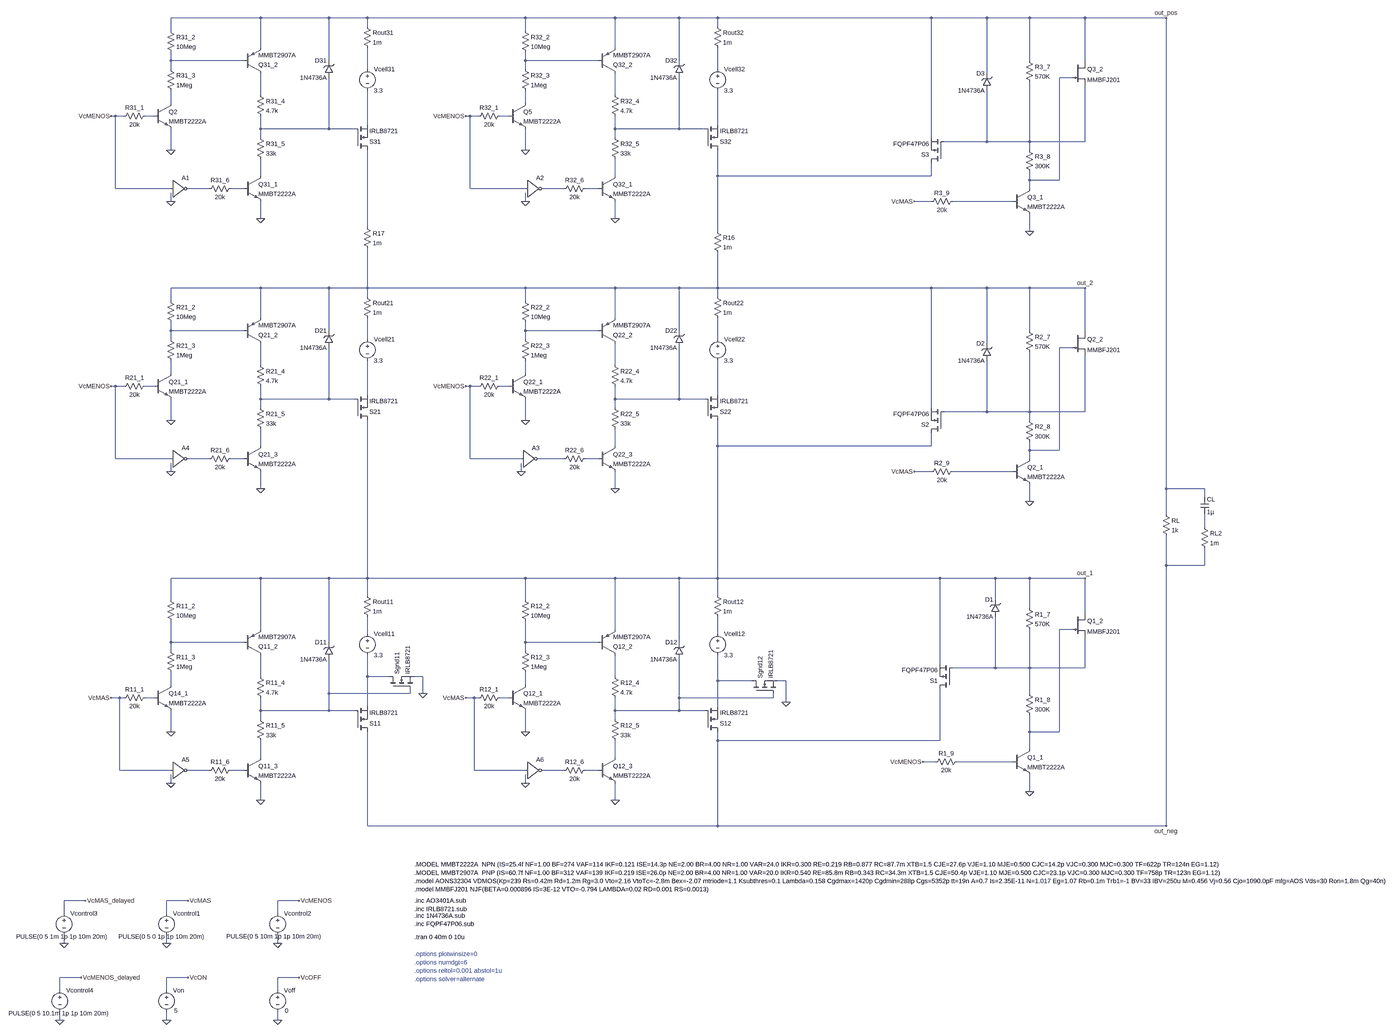
[diagram p0: schematic Matriz3x2 - Nuevo PMOS - FQPF47P06.asc, whole sheet]
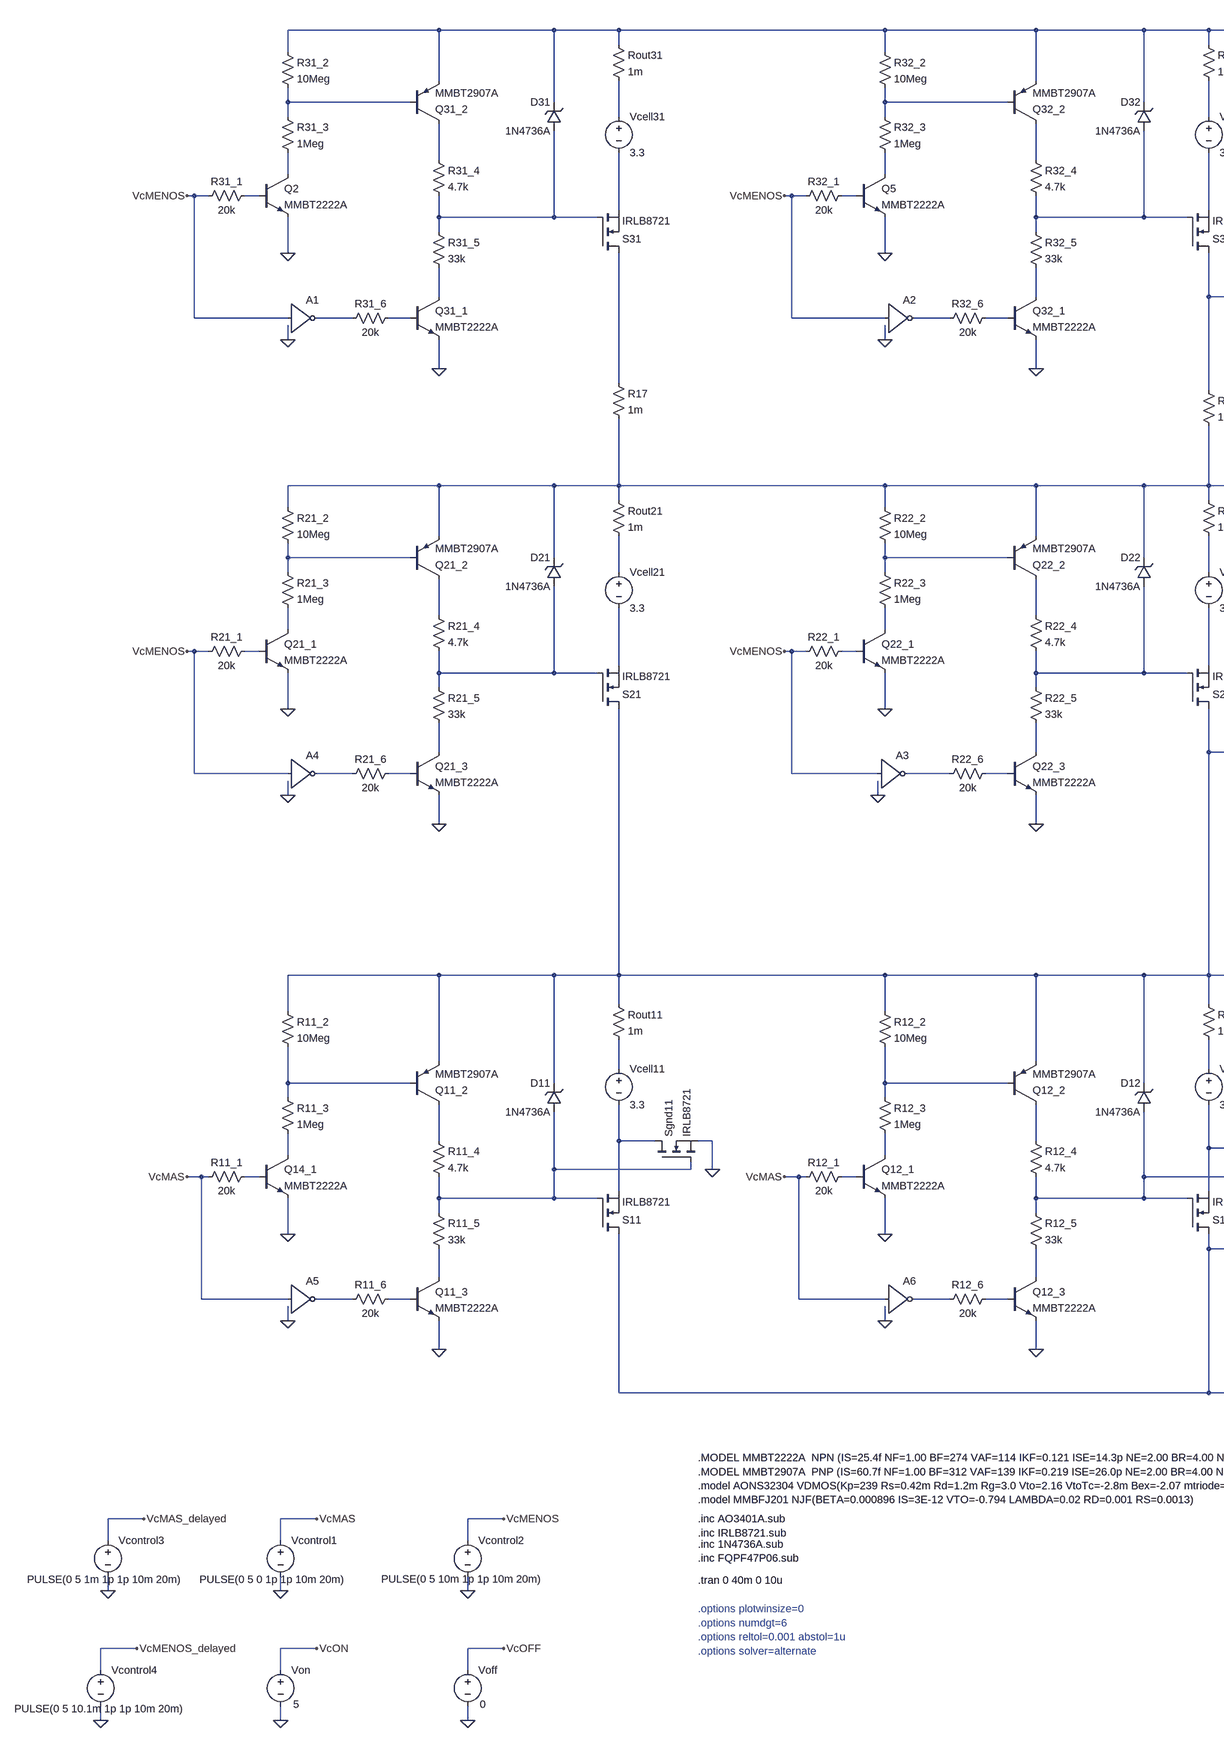
[diagram p1: schematic Matriz3x2 - Nuevo PMOS - FQPF47P06.asc, part, row 1 of 1, column 1 of 2]
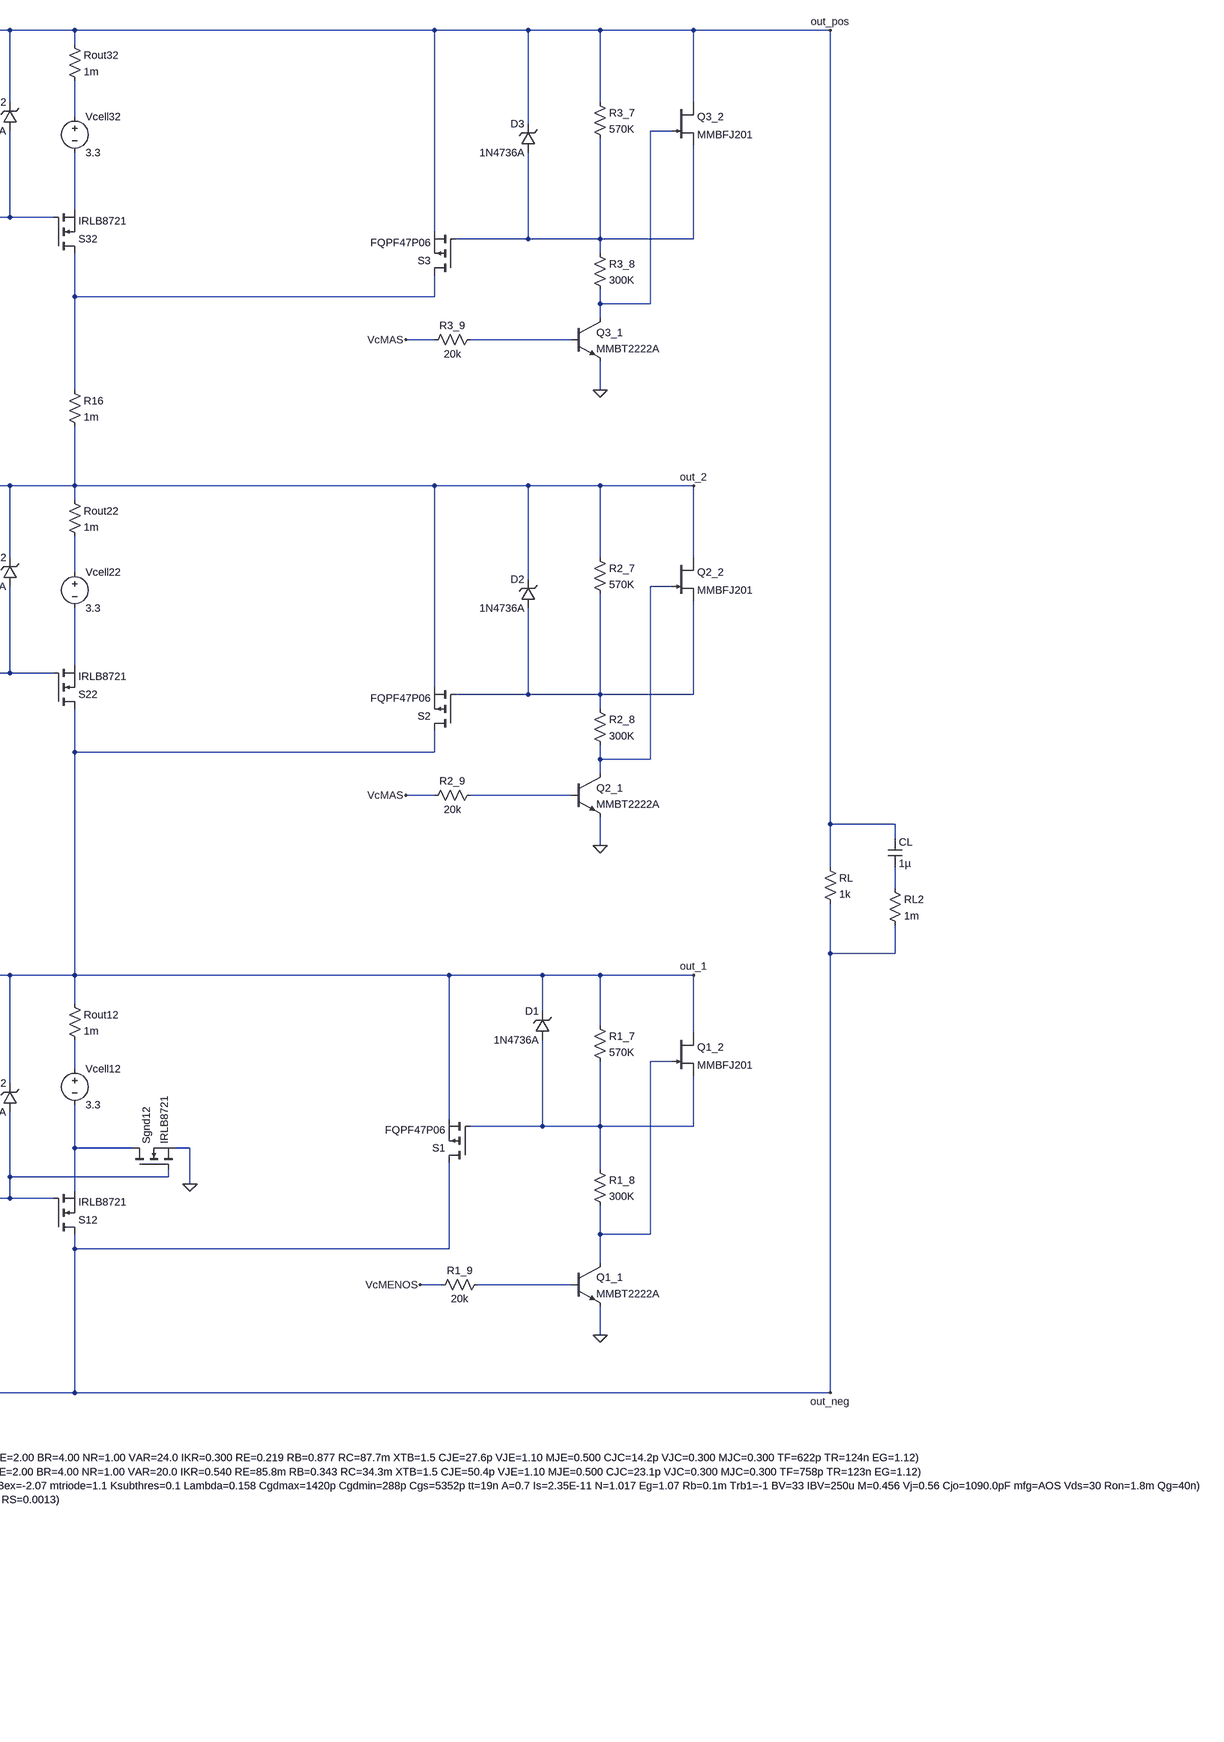
[diagram p2: schematic Matriz3x2 - Nuevo PMOS - FQPF47P06.asc, part, row 1 of 1, column 2 of 2]
Matriz3x2 - Nuevo PMOS - FQPF47P06.asc, the LTspice schematic file:
Version 4.1
SHEET 1 5536 2128
WIRE -800 -2512 -1136 -2512
WIRE -544 -2512 -800 -2512
WIRE -400 -2512 -544 -2512
WIRE 192 -2512 -400 -2512
WIRE 528 -2512 192 -2512
WIRE 768 -2512 528 -2512
WIRE 912 -2512 768 -2512
WIRE 1712 -2512 912 -2512
WIRE 1920 -2512 1712 -2512
WIRE 2080 -2512 1920 -2512
WIRE 2288 -2512 2080 -2512
WIRE 2592 -2512 2288 -2512
WIRE -400 -2480 -400 -2512
WIRE 912 -2480 912 -2512
WIRE -1136 -2464 -1136 -2512
WIRE 192 -2464 192 -2512
WIRE -800 -2400 -800 -2512
WIRE 528 -2400 528 -2512
WIRE -1136 -2352 -1136 -2384
WIRE -864 -2352 -1136 -2352
WIRE -544 -2352 -544 -2512
WIRE 192 -2352 192 -2384
WIRE 464 -2352 192 -2352
WIRE 768 -2352 768 -2512
WIRE 2080 -2352 2080 -2512
WIRE 2288 -2352 2288 -2512
WIRE -1136 -2320 -1136 -2352
WIRE -400 -2320 -400 -2400
WIRE 192 -2320 192 -2352
WIRE 912 -2320 912 -2400
WIRE 1920 -2304 1920 -2512
WIRE 2240 -2288 2192 -2288
WIRE -800 -2224 -800 -2304
WIRE 528 -2224 528 -2304
WIRE -1136 -2192 -1136 -2240
WIRE 192 -2192 192 -2240
WIRE -1344 -2144 -1360 -2144
WIRE -1312 -2144 -1344 -2144
WIRE -1200 -2144 -1232 -2144
WIRE -16 -2144 -32 -2144
WIRE 16 -2144 -16 -2144
WIRE 128 -2144 96 -2144
WIRE -400 -2112 -400 -2240
WIRE 912 -2112 912 -2240
WIRE -800 -2096 -800 -2144
WIRE -544 -2096 -544 -2288
WIRE -544 -2096 -800 -2096
WIRE -448 -2096 -544 -2096
WIRE 528 -2096 528 -2144
WIRE 768 -2096 768 -2288
WIRE 768 -2096 528 -2096
WIRE 864 -2096 768 -2096
WIRE -800 -2064 -800 -2096
WIRE 528 -2064 528 -2096
WIRE 1712 -2064 1712 -2512
WIRE 1920 -2048 1920 -2240
WIRE 1920 -2048 1760 -2048
WIRE 2080 -2048 2080 -2272
WIRE 2080 -2048 1920 -2048
WIRE 2288 -2048 2288 -2256
WIRE 2288 -2048 2080 -2048
WIRE -1136 -2016 -1136 -2096
WIRE 192 -2016 192 -2096
WIRE 2080 -2016 2080 -2048
WIRE -800 -1920 -800 -1984
WIRE 528 -1920 528 -1984
WIRE 912 -1920 912 -2016
WIRE 1712 -1920 1712 -1968
WIRE 1712 -1920 912 -1920
WIRE 2080 -1904 2080 -1936
WIRE 2192 -1904 2192 -2288
WIRE 2192 -1904 2080 -1904
WIRE -1344 -1872 -1344 -2144
WIRE -1136 -1872 -1344 -1872
WIRE -992 -1872 -1072 -1872
WIRE -864 -1872 -912 -1872
WIRE -16 -1872 -16 -2144
WIRE 192 -1872 -16 -1872
WIRE 336 -1872 256 -1872
WIRE 464 -1872 416 -1872
WIRE 2080 -1872 2080 -1904
WIRE -1136 -1824 -1136 -1856
WIRE 192 -1824 192 -1856
WIRE 1712 -1824 1648 -1824
WIRE 2016 -1824 1792 -1824
WIRE -800 -1760 -800 -1824
WIRE 528 -1760 528 -1824
WIRE -400 -1728 -400 -2016
WIRE 912 -1712 912 -1920
WIRE 2080 -1712 2080 -1776
WIRE -800 -1456 -1136 -1456
WIRE -544 -1456 -800 -1456
WIRE -400 -1456 -400 -1648
WIRE -400 -1456 -544 -1456
WIRE 192 -1456 -400 -1456
WIRE 528 -1456 192 -1456
WIRE 768 -1456 528 -1456
WIRE 912 -1456 912 -1632
WIRE 912 -1456 768 -1456
WIRE 1712 -1456 912 -1456
WIRE 1920 -1456 1712 -1456
WIRE 2080 -1456 1920 -1456
WIRE 2288 -1456 2080 -1456
WIRE -400 -1424 -400 -1456
WIRE 912 -1424 912 -1456
WIRE -1136 -1408 -1136 -1456
WIRE 192 -1408 192 -1456
WIRE -800 -1344 -800 -1456
WIRE 528 -1344 528 -1456
WIRE -1136 -1296 -1136 -1328
WIRE -864 -1296 -1136 -1296
WIRE -544 -1296 -544 -1456
WIRE 192 -1296 192 -1328
WIRE 464 -1296 192 -1296
WIRE 768 -1296 768 -1456
WIRE 2080 -1296 2080 -1456
WIRE 2288 -1296 2288 -1456
WIRE -1136 -1264 -1136 -1296
WIRE -400 -1264 -400 -1344
WIRE 192 -1264 192 -1296
WIRE 912 -1264 912 -1344
WIRE 1920 -1248 1920 -1456
WIRE 2240 -1232 2192 -1232
WIRE -800 -1168 -800 -1248
WIRE 528 -1168 528 -1248
WIRE -1136 -1136 -1136 -1184
WIRE 192 -1136 192 -1184
WIRE -1344 -1088 -1360 -1088
WIRE -1312 -1088 -1344 -1088
WIRE -1200 -1088 -1232 -1088
WIRE -16 -1088 -32 -1088
WIRE 16 -1088 -16 -1088
WIRE 128 -1088 96 -1088
WIRE -400 -1056 -400 -1184
WIRE 912 -1056 912 -1184
WIRE -800 -1040 -800 -1088
WIRE -544 -1040 -544 -1232
WIRE -544 -1040 -800 -1040
WIRE -448 -1040 -544 -1040
WIRE 528 -1040 528 -1088
WIRE 768 -1040 768 -1232
WIRE 768 -1040 528 -1040
WIRE 864 -1040 768 -1040
WIRE -800 -1008 -800 -1040
WIRE 528 -1008 528 -1040
WIRE 1712 -1008 1712 -1456
WIRE 1920 -992 1920 -1184
WIRE 1920 -992 1760 -992
WIRE 2080 -992 2080 -1216
WIRE 2080 -992 1920 -992
WIRE 2288 -992 2288 -1200
WIRE 2288 -992 2080 -992
WIRE -1136 -960 -1136 -1040
WIRE 192 -960 192 -1040
WIRE 2080 -960 2080 -992
WIRE -800 -864 -800 -928
WIRE 528 -864 528 -928
WIRE 912 -864 912 -960
WIRE 1712 -864 1712 -912
WIRE 1712 -864 912 -864
WIRE 2080 -848 2080 -880
WIRE 2192 -848 2192 -1232
WIRE 2192 -848 2080 -848
WIRE -1344 -816 -1344 -1088
WIRE -1136 -816 -1344 -816
WIRE -992 -816 -1072 -816
WIRE -864 -816 -912 -816
WIRE -16 -816 -16 -1088
WIRE 176 -816 -16 -816
WIRE 336 -816 240 -816
WIRE 464 -816 416 -816
WIRE 2080 -816 2080 -848
WIRE -1136 -768 -1136 -800
WIRE 176 -768 176 -800
WIRE 1712 -768 1648 -768
WIRE 2016 -768 1792 -768
WIRE -800 -704 -800 -768
WIRE 528 -704 528 -768
WIRE 2592 -704 2592 -2512
WIRE 2736 -704 2592 -704
WIRE 2736 -672 2736 -704
WIRE 2080 -656 2080 -720
WIRE 2592 -608 2592 -704
WIRE 2736 -560 2736 -608
WIRE 2592 -416 2592 -528
WIRE 2736 -416 2736 -480
WIRE 2736 -416 2592 -416
WIRE -800 -368 -1136 -368
WIRE -544 -368 -800 -368
WIRE -400 -368 -400 -960
WIRE -400 -368 -544 -368
WIRE 192 -368 -400 -368
WIRE 528 -368 192 -368
WIRE 768 -368 528 -368
WIRE 912 -368 912 -864
WIRE 912 -368 768 -368
WIRE 1744 -368 912 -368
WIRE 1952 -368 1744 -368
WIRE 2080 -368 1952 -368
WIRE 2288 -368 2080 -368
WIRE -400 -304 -400 -368
WIRE 912 -304 912 -368
WIRE -1136 -288 -1136 -368
WIRE 192 -288 192 -368
WIRE 1952 -288 1952 -368
WIRE 2080 -256 2080 -368
WIRE 2288 -240 2288 -368
WIRE -800 -176 -800 -368
WIRE 528 -176 528 -368
WIRE 2240 -176 2192 -176
WIRE -400 -160 -400 -224
WIRE 912 -160 912 -224
WIRE -1136 -128 -1136 -208
WIRE -864 -128 -1136 -128
WIRE -544 -128 -544 -368
WIRE 192 -128 192 -208
WIRE 464 -128 192 -128
WIRE 768 -128 768 -368
WIRE -1136 -96 -1136 -128
WIRE 192 -96 192 -128
WIRE 1744 -48 1744 -368
WIRE 1952 -32 1952 -224
WIRE 1952 -32 1792 -32
WIRE 2080 -32 2080 -176
WIRE 2080 -32 1952 -32
WIRE 2288 -32 2288 -144
WIRE 2288 -32 2080 -32
WIRE -800 0 -800 -80
WIRE -400 0 -400 -80
WIRE -320 0 -400 0
WIRE -192 0 -224 0
WIRE 528 0 528 -80
WIRE 912 16 912 -80
WIRE 1040 16 912 16
WIRE 1168 16 1136 16
WIRE -1136 32 -1136 -16
WIRE 192 32 192 -16
WIRE -544 64 -544 -64
WIRE -240 64 -240 48
WIRE -240 64 -544 64
WIRE -192 64 -192 0
WIRE 2080 64 2080 -32
WIRE -1328 80 -1360 80
WIRE -1312 80 -1328 80
WIRE -1200 80 -1232 80
WIRE 0 80 -32 80
WIRE 16 80 0 80
WIRE 128 80 96 80
WIRE 768 80 768 -64
WIRE 1120 80 1120 64
WIRE 1120 80 768 80
WIRE 1168 96 1168 16
WIRE -400 112 -400 0
WIRE 912 112 912 16
WIRE -800 128 -800 80
WIRE -544 128 -544 64
WIRE -544 128 -800 128
WIRE -448 128 -544 128
WIRE 528 128 528 80
WIRE 768 128 768 80
WIRE 768 128 528 128
WIRE 864 128 768 128
WIRE -800 160 -800 128
WIRE 528 160 528 128
WIRE -1136 208 -1136 128
WIRE 192 208 192 128
WIRE 2080 208 2080 144
WIRE 2192 208 2192 -176
WIRE 2192 208 2080 208
WIRE 912 240 912 208
WIRE 1744 240 1744 48
WIRE 1744 240 912 240
WIRE 2080 272 2080 208
WIRE -800 304 -800 240
WIRE 528 304 528 240
WIRE 1728 320 1680 320
WIRE 2016 320 1808 320
WIRE -1328 352 -1328 80
WIRE -1136 352 -1328 352
WIRE -992 352 -1072 352
WIRE -864 352 -912 352
WIRE 0 352 0 80
WIRE 192 352 0 352
WIRE 336 352 256 352
WIRE 464 352 416 352
WIRE -1136 400 -1136 368
WIRE 192 400 192 368
WIRE 2080 432 2080 368
WIRE -800 464 -800 400
WIRE 528 464 528 400
WIRE -400 560 -400 208
WIRE 912 560 912 240
WIRE 912 560 -400 560
WIRE 2592 560 2592 -416
WIRE 2592 560 912 560
WIRE -1456 1024 -1536 1024
WIRE -1072 1024 -1152 1024
WIRE -656 1024 -736 1024
WIRE -1536 1072 -1536 1024
WIRE -1152 1072 -1152 1024
WIRE -736 1072 -736 1024
WIRE -1536 1184 -1536 1152
WIRE -1152 1184 -1152 1152
WIRE -736 1184 -736 1152
WIRE -1472 1312 -1552 1312
WIRE -1072 1312 -1152 1312
WIRE -656 1312 -736 1312
WIRE -1552 1360 -1552 1312
WIRE -1152 1360 -1152 1312
WIRE -736 1360 -736 1312
WIRE -1552 1472 -1552 1440
WIRE -1152 1472 -1152 1440
WIRE -736 1472 -736 1440
FLAG -1136 208 0
FLAG -800 464 0
FLAG 192 208 0
FLAG 528 464 0
FLAG -1136 -960 0
FLAG -800 -704 0
FLAG 192 -960 0
FLAG 528 -704 0
FLAG -1152 1184 0
FLAG -736 1184 0
FLAG -1072 1024 VcMAS
FLAG -656 1024 VcMENOS
FLAG -736 1472 0
FLAG -656 1312 VcOFF
FLAG -1152 1472 0
FLAG -1072 1312 VcON
FLAG -1360 80 VcMAS
FLAG -1360 -1088 VcMENOS
FLAG -32 -1088 VcMENOS
FLAG -32 80 VcMAS
FLAG 2592 560 out_neg
FLAG 2288 -368 out_1
FLAG 2080 432 0
FLAG 1680 320 VcMENOS
FLAG 2080 -656 0
FLAG 1648 -768 VcMAS
FLAG 2592 -2512 out_pos
FLAG -1536 1184 0
FLAG -1456 1024 VcMAS_delayed
FLAG -1552 1472 0
FLAG -1472 1312 VcMENOS_delayed
FLAG 1168 96 0
FLAG -192 64 0
FLAG -1136 -2016 0
FLAG -800 -1760 0
FLAG 192 -2016 0
FLAG 528 -1760 0
FLAG -1360 -2144 VcMENOS
FLAG -32 -2144 VcMENOS
FLAG 2080 -1712 0
FLAG 1648 -1824 VcMAS
FLAG -1136 -1824 0
FLAG 192 -1824 0
FLAG 176 -768 0
FLAG -1136 -768 0
FLAG -1136 400 0
FLAG 192 400 0
FLAG 2288 -1456 out_2
SYMBOL npn -864 304 R0
SYMATTR InstName Q11_3
SYMATTR Value MMBT2222A
SYMBOL res -816 144 R0
SYMATTR InstName R11_5
SYMATTR Value 33k
SYMBOL res -816 -16 R0
SYMATTR InstName R11_4
SYMATTR Value 4.7k
SYMBOL npn -1200 32 R0
SYMATTR InstName Q14_1
SYMATTR Value MMBT2222A
SYMBOL res -1152 -112 R0
SYMATTR InstName R11_3
SYMATTR Value 1Meg
SYMBOL res -1152 -304 R0
SYMATTR InstName R11_2
SYMATTR Value 10Meg
SYMBOL res -896 336 R90
WINDOW 0 0 56 VBottom 2
WINDOW 3 32 56 VTop 2
SYMATTR InstName R11_6
SYMATTR Value 20k
SYMBOL voltage -400 -176 R0
WINDOW 123 0 0 Left 0
WINDOW 39 0 0 Left 0
SYMATTR InstName Vcell11
SYMATTR Value 3.3
SYMBOL pnp -864 -80 M180
SYMATTR InstName Q11_2
SYMATTR Value MMBT2907A
SYMBOL nmos -448 208 M180
SYMATTR InstName S11
SYMATTR Value IRLB8721
SYMATTR Prefix X
SYMBOL npn 464 304 R0
SYMATTR InstName Q12_3
SYMATTR Value MMBT2222A
SYMBOL res 512 144 R0
SYMATTR InstName R12_5
SYMATTR Value 33k
SYMBOL res 512 -16 R0
SYMATTR InstName R12_4
SYMATTR Value 4.7k
SYMBOL npn 128 32 R0
SYMATTR InstName Q12_1
SYMATTR Value MMBT2222A
SYMBOL res 176 -112 R0
SYMATTR InstName R12_3
SYMATTR Value 1Meg
SYMBOL res 176 -304 R0
SYMATTR InstName R12_2
SYMATTR Value 10Meg
SYMBOL res 432 336 R90
WINDOW 0 0 56 VBottom 2
WINDOW 3 32 56 VTop 2
SYMATTR InstName R12_6
SYMATTR Value 20k
SYMBOL voltage 912 -176 R0
WINDOW 123 0 0 Left 0
WINDOW 39 0 0 Left 0
SYMATTR InstName Vcell12
SYMATTR Value 3.3
SYMBOL pnp 464 -80 M180
SYMATTR InstName Q12_2
SYMATTR Value MMBT2907A
SYMBOL nmos 864 208 M180
SYMATTR InstName S12
SYMATTR Value IRLB8721
SYMATTR Prefix X
SYMBOL npn -864 -864 R0
SYMATTR InstName Q21_3
SYMATTR Value MMBT2222A
SYMBOL res -816 -1024 R0
SYMATTR InstName R21_5
SYMATTR Value 33k
SYMBOL res -816 -1184 R0
SYMATTR InstName R21_4
SYMATTR Value 4.7k
SYMBOL npn -1200 -1136 R0
SYMATTR InstName Q21_1
SYMATTR Value MMBT2222A
SYMBOL res -1152 -1280 R0
SYMATTR InstName R21_3
SYMATTR Value 1Meg
SYMBOL res -1152 -1424 R0
SYMATTR InstName R21_2
SYMATTR Value 10Meg
SYMBOL res -896 -832 R90
WINDOW 0 0 56 VBottom 2
WINDOW 3 32 56 VTop 2
SYMATTR InstName R21_6
SYMATTR Value 20k
SYMBOL voltage -400 -1280 R0
WINDOW 123 0 0 Left 0
WINDOW 39 0 0 Left 0
SYMATTR InstName Vcell21
SYMATTR Value 3.3
SYMBOL pnp -864 -1248 M180
SYMATTR InstName Q21_2
SYMATTR Value MMBT2907A
SYMBOL nmos -448 -960 M180
SYMATTR InstName S21
SYMATTR Value IRLB8721
SYMATTR Prefix X
SYMBOL npn 464 -864 R0
SYMATTR InstName Q22_3
SYMATTR Value MMBT2222A
SYMBOL res 512 -1024 R0
SYMATTR InstName R22_5
SYMATTR Value 33k
SYMBOL res 512 -1184 R0
SYMATTR InstName R22_4
SYMATTR Value 4.7k
SYMBOL npn 128 -1136 R0
SYMATTR InstName Q22_1
SYMATTR Value MMBT2222A
SYMBOL res 176 -1280 R0
SYMATTR InstName R22_3
SYMATTR Value 1Meg
SYMBOL res 176 -1424 R0
SYMATTR InstName R22_2
SYMATTR Value 10Meg
SYMBOL res 432 -832 R90
WINDOW 0 0 56 VBottom 2
WINDOW 3 32 56 VTop 2
SYMATTR InstName R22_6
SYMATTR Value 20k
SYMBOL voltage 912 -1280 R0
WINDOW 123 0 0 Left 0
WINDOW 39 0 0 Left 0
SYMATTR InstName Vcell22
SYMATTR Value 3.3
SYMBOL pnp 464 -1248 M180
SYMATTR InstName Q22_2
SYMATTR Value MMBT2907A
SYMBOL nmos 864 -960 M180
SYMATTR InstName S22
SYMATTR Value IRLB8721
SYMATTR Prefix X
SYMBOL voltage -1152 1056 R0
WINDOW 3 -180 103 Left 2
WINDOW 123 0 0 Left 0
WINDOW 39 0 0 Left 0
SYMATTR Value PULSE(0 5 0 1p 1p 10m 20m)
SYMATTR InstName Vcontrol1
SYMBOL voltage -736 1056 R0
WINDOW 3 -192 102 Left 2
WINDOW 123 0 0 Left 0
WINDOW 39 0 0 Left 0
SYMATTR Value PULSE(0 5 10m 1p 1p 10m 20m)
SYMATTR InstName Vcontrol2
SYMBOL voltage -736 1344 R0
WINDOW 3 27 92 Left 2
WINDOW 123 0 0 Left 0
WINDOW 39 0 0 Left 0
SYMATTR Value 0
SYMATTR InstName Voff
SYMBOL voltage -1152 1344 R0
WINDOW 3 28 92 Left 2
WINDOW 123 0 0 Left 0
WINDOW 39 0 0 Left 0
SYMATTR Value 5
SYMATTR InstName Von
SYMBOL res -1216 64 R90
WINDOW 0 0 56 VBottom 2
WINDOW 3 32 56 VTop 2
SYMATTR InstName R11_1
SYMATTR Value 20k
SYMBOL res -1216 -1104 R90
WINDOW 0 0 56 VBottom 2
WINDOW 3 32 56 VTop 2
SYMATTR InstName R21_1
SYMATTR Value 20k
SYMBOL res 112 -1104 R90
WINDOW 0 0 56 VBottom 2
WINDOW 3 32 56 VTop 2
SYMATTR InstName R22_1
SYMATTR Value 20k
SYMBOL res 112 64 R90
WINDOW 0 0 56 VBottom 2
WINDOW 3 32 56 VTop 2
SYMATTR InstName R12_1
SYMATTR Value 20k
SYMBOL res 2576 -624 R0
SYMATTR InstName RL
SYMATTR Value 1k
SYMBOL res 896 -320 R0
SYMATTR InstName Rout12
SYMATTR Value 1m
SYMBOL res -416 -320 R0
SYMATTR InstName Rout11
SYMATTR Value 1m
SYMBOL res -416 -1440 R0
SYMATTR InstName Rout21
SYMATTR Value 1m
SYMBOL res 896 -1440 R0
SYMATTR InstName Rout22
SYMATTR Value 1m
SYMBOL npn 2016 272 R0
SYMATTR InstName Q1_1
SYMATTR Value MMBT2222A
SYMBOL res 1824 304 R90
WINDOW 0 0 56 VBottom 2
WINDOW 3 32 56 VTop 2
SYMATTR InstName R1_9
SYMATTR Value 20k
SYMBOL res 2064 48 R0
SYMATTR InstName R1_8
SYMATTR Value 300K
SYMBOL res 2064 -272 R0
SYMATTR InstName R1_7
SYMATTR Value 570K
SYMBOL npn 2016 -816 R0
SYMATTR InstName Q2_1
SYMATTR Value MMBT2222A
SYMBOL res 1808 -784 R90
WINDOW 0 0 56 VBottom 2
WINDOW 3 32 56 VTop 2
SYMATTR InstName R2_9
SYMATTR Value 20k
SYMBOL res 2064 -976 R0
SYMATTR InstName R2_8
SYMATTR Value 300K
SYMBOL res 2064 -1312 R0
SYMATTR InstName R2_7
SYMATTR Value 570K
SYMBOL pmos 1792 48 R180
SYMATTR InstName S1
SYMATTR Value FQPF47P06
SYMATTR Prefix X
SYMBOL pmos 1760 -912 R180
SYMATTR InstName S2
SYMATTR Value FQPF47P06
SYMATTR Prefix X
SYMBOL njf 2240 -240 R0
SYMATTR InstName Q1_2
SYMATTR Value MMBFJ201
SYMBOL njf 2240 -1296 R0
SYMATTR InstName Q2_2
SYMATTR Value MMBFJ201
SYMBOL zener 1936 -1184 R180
WINDOW 0 24 64 Left 2
WINDOW 3 24 0 Left 2
SYMATTR InstName D2
SYMATTR Value 1N4736A
SYMATTR Prefix x
SYMBOL zener 784 -1232 R180
WINDOW 0 24 64 Left 2
WINDOW 3 24 0 Left 2
SYMATTR InstName D22
SYMATTR Value 1N4736A
SYMATTR Prefix X
SYMBOL zener -528 -1232 R180
WINDOW 0 24 64 Left 2
WINDOW 3 24 0 Left 2
SYMATTR InstName D21
SYMATTR Value 1N4736A
SYMATTR Prefix X
SYMBOL zener -528 -64 R180
WINDOW 0 24 64 Left 2
WINDOW 3 24 0 Left 2
SYMATTR InstName D11
SYMATTR Value 1N4736A
SYMATTR Prefix X
SYMBOL zener 784 -64 R180
WINDOW 0 24 64 Left 2
WINDOW 3 24 0 Left 2
SYMATTR InstName D12
SYMATTR Value 1N4736A
SYMATTR Prefix X
SYMBOL zener 1968 -224 R180
WINDOW 0 24 64 Left 2
WINDOW 3 24 0 Left 2
SYMATTR InstName D1
SYMATTR Value 1N4736A
SYMATTR Prefix x
SYMBOL voltage -1536 1056 R0
WINDOW 3 -180 103 Left 2
WINDOW 123 0 0 Left 0
WINDOW 39 0 0 Left 0
SYMATTR Value PULSE(0 5 1m 1p 1p 10m 20m)
SYMATTR InstName Vcontrol3
SYMBOL voltage -1552 1344 R0
WINDOW 3 -192 102 Left 2
WINDOW 123 0 0 Left 0
WINDOW 39 0 0 Left 0
SYMATTR Value PULSE(0 5 10.1m 1p 1p 10m 20m)
SYMATTR InstName Vcontrol4
SYMBOL cap 2720 -672 R0
SYMATTR InstName CL
SYMATTR Value 1µ
SYMBOL res 2720 -576 R0
SYMATTR InstName RL2
SYMATTR Value 1m
SYMBOL nmos -320 48 R270
SYMATTR InstName Sgnd11
SYMATTR Value IRLB8721
SYMATTR Prefix X
SYMBOL nmos 1040 64 R270
SYMATTR InstName Sgnd12
SYMATTR Value IRLB8721
SYMATTR Prefix X
SYMBOL npn -864 -1920 R0
SYMATTR InstName Q31_1
SYMATTR Value MMBT2222A
SYMBOL res -816 -2080 R0
SYMATTR InstName R31_5
SYMATTR Value 33k
SYMBOL res -816 -2240 R0
SYMATTR InstName R31_4
SYMATTR Value 4.7k
SYMBOL npn -1200 -2192 R0
SYMATTR InstName Q2
SYMATTR Value MMBT2222A
SYMBOL res -1152 -2336 R0
SYMATTR InstName R31_3
SYMATTR Value 1Meg
SYMBOL res -1152 -2480 R0
SYMATTR InstName R31_2
SYMATTR Value 10Meg
SYMBOL res -896 -1888 R90
WINDOW 0 0 56 VBottom 2
WINDOW 3 32 56 VTop 2
SYMATTR InstName R31_6
SYMATTR Value 20k
SYMBOL voltage -400 -2336 R0
WINDOW 123 0 0 Left 0
WINDOW 39 0 0 Left 0
SYMATTR InstName Vcell31
SYMATTR Value 3.3
SYMBOL pnp -864 -2304 M180
SYMATTR InstName Q31_2
SYMATTR Value MMBT2907A
SYMBOL nmos -448 -2016 M180
SYMATTR InstName S31
SYMATTR Value IRLB8721
SYMATTR Prefix X
SYMBOL npn 464 -1920 R0
SYMATTR InstName Q32_1
SYMATTR Value MMBT2222A
SYMBOL res 512 -2080 R0
SYMATTR InstName R32_5
SYMATTR Value 33k
SYMBOL res 512 -2240 R0
SYMATTR InstName R32_4
SYMATTR Value 4.7k
SYMBOL npn 128 -2192 R0
SYMATTR InstName Q5
SYMATTR Value MMBT2222A
SYMBOL res 176 -2336 R0
SYMATTR InstName R32_3
SYMATTR Value 1Meg
SYMBOL res 176 -2480 R0
SYMATTR InstName R32_2
SYMATTR Value 10Meg
SYMBOL res 432 -1888 R90
WINDOW 0 0 56 VBottom 2
WINDOW 3 32 56 VTop 2
SYMATTR InstName R32_6
SYMATTR Value 20k
SYMBOL voltage 912 -2336 R0
WINDOW 123 0 0 Left 0
WINDOW 39 0 0 Left 0
SYMATTR InstName Vcell32
SYMATTR Value 3.3
SYMBOL pnp 464 -2304 M180
SYMATTR InstName Q32_2
SYMATTR Value MMBT2907A
SYMBOL nmos 864 -2016 M180
SYMATTR InstName S32
SYMATTR Value IRLB8721
SYMATTR Prefix X
SYMBOL res -1216 -2160 R90
WINDOW 0 0 56 VBottom 2
WINDOW 3 32 56 VTop 2
SYMATTR InstName R31_1
SYMATTR Value 20k
SYMBOL res 112 -2160 R90
WINDOW 0 0 56 VBottom 2
WINDOW 3 32 56 VTop 2
SYMATTR InstName R32_1
SYMATTR Value 20k
SYMBOL res -416 -2496 R0
SYMATTR InstName Rout31
SYMATTR Value 1m
SYMBOL res 896 -2496 R0
SYMATTR InstName Rout32
SYMATTR Value 1m
SYMBOL npn 2016 -1872 R0
SYMATTR InstName Q3_1
SYMATTR Value MMBT2222A
SYMBOL res 1808 -1840 R90
WINDOW 0 0 56 VBottom 2
WINDOW 3 32 56 VTop 2
SYMATTR InstName R3_9
SYMATTR Value 20k
SYMBOL res 2064 -2032 R0
SYMATTR InstName R3_8
SYMATTR Value 300K
SYMBOL res 2064 -2368 R0
SYMATTR InstName R3_7
SYMATTR Value 570K
SYMBOL pmos 1760 -1968 R180
SYMATTR InstName S3
SYMATTR Value FQPF47P06
SYMATTR Prefix X
SYMBOL njf 2240 -2352 R0
SYMATTR InstName Q3_2
SYMATTR Value MMBFJ201
SYMBOL zener 1936 -2240 R180
WINDOW 0 24 64 Left 2
WINDOW 3 24 0 Left 2
SYMATTR InstName D3
SYMATTR Value 1N4736A
SYMATTR Prefix x
SYMBOL zener 784 -2288 R180
WINDOW 0 24 64 Left 2
WINDOW 3 24 0 Left 2
SYMATTR InstName D32
SYMATTR Value 1N4736A
SYMATTR Prefix X
SYMBOL zener -528 -2288 R180
WINDOW 0 24 64 Left 2
WINDOW 3 24 0 Left 2
SYMATTR InstName D31
SYMATTR Value 1N4736A
SYMATTR Prefix X
SYMBOL res 896 -1728 R0
SYMATTR InstName R16
SYMATTR Value 1m
SYMBOL res -416 -1744 R0
SYMATTR InstName R17
SYMATTR Value 1m
SYMBOL Digital\\inv -1136 -1936 R0
SYMATTR InstName A1
SYMBOL Digital\\inv 192 -1936 R0
SYMATTR InstName A2
SYMBOL Digital\\inv 176 -880 R0
SYMATTR InstName A3
SYMBOL Digital\\inv -1136 -880 R0
SYMATTR InstName A4
SYMBOL Digital\\inv -1136 288 R0
SYMATTR InstName A5
SYMBOL Digital\\inv 192 288 R0
SYMATTR InstName A6
TEXT -224 1160 Left 2 !.tran 0 40m 0 10u
TEXT -224 888 Left 2 !.MODEL MMBT2222A  NPN (IS=25.4f NF=1.00 BF=274 VAF=114 IKF=0.121 ISE=14.3p NE=2.00 BR=4.00 NR=1.00 VAR=24.0 IKR=0.300 RE=0.219 RB=0.877 RC=87.7m XTB=1.5 CJE=27.6p VJE=1.10 MJE=0.500 CJC=14.2p VJC=0.300 MJC=0.300 TF=622p TR=124n EG=1.12)\n.MODEL MMBT2907A  PNP (IS=60.7f NF=1.00 BF=312 VAF=139 IKF=0.219 ISE=26.0p NE=2.00 BR=4.00 NR=1.00 VAR=20.0 IKR=0.540 RE=85.8m RB=0.343 RC=34.3m XTB=1.5 CJE=50.4p VJE=1.10 MJE=0.500 CJC=23.1p VJC=0.300 MJC=0.300 TF=758p TR=123n EG=1.12)\n.model AONS32304 VDMOS(Kp=239 Rs=0.42m Rd=1.2m Rg=3.0 Vto=2.16 VtoTc=-2.8m Bex=-2.07 mtriode=1.1 Ksubthres=0.1 Lambda=0.158 Cgdmax=1420p Cgdmin=288p Cgs=5352p tt=19n A=0.7 Is=2.35E-11 N=1.017 Eg=1.07 Rb=0.1m Trb1=-1 BV=33 IBV=250u M=0.456 Vj=0.56 Cjo=1090.0pF mfg=AOS Vds=30 Ron=1.8m Qg=40n)\n.model MMBFJ201 NJF(BETA=0.000896 IS=3E-12 VTO=-0.794 LAMBDA=0.02 RD=0.001 RS=0.0013)
TEXT -224 1024 Left 2 !.inc AO3401A.sub\n.inc IRLB8721.sub
TEXT -224 1080 Left 2 !.inc 1N4736A.sub\n.inc FQPF47P06.sub
TEXT -224 1224 Left 2 ;.options plotwinsize=0\n.options numdgt=6\n.options reltol=0.001 abstol=1u\n.options solver=alternate

The netlist it stands for:
* Matriz3x2 - Nuevo PMOS - FQPF47P06.asc
Q11_3 N066 N070 0 0 MMBT2222A
R11_5 N062 N066 33k
R11_4 N056 N062 4.7k
Q14_1 N060 N063 0 0 MMBT2222A
R11_3 N053 N060 1Meg
R11_2 out_1 N053 10Meg
R11_6 N070 N069 20k
Vcell11 N051 N057 3.3
Q11_2 N056 N053 out_1 0 MMBT2907A
X§S11 out_neg N062 N057 IRLB8721  ; pins D G S
Q12_3 N067 N072 0 0 MMBT2222A
R12_5 N065 N067 33k
R12_4 N058 N065 4.7k
Q12_1 N061 N064 0 0 MMBT2222A
R12_3 N054 N061 1Meg
R12_2 out_1 N054 10Meg
R12_6 N072 N071 20k
Vcell12 N052 N059 3.3
Q12_2 N058 N054 out_1 0 MMBT2907A
X§S12 out_neg N065 N059 IRLB8721  ; pins D G S
Q21_3 N042 N045 0 0 MMBT2222A
R21_5 N039 N042 33k
R21_4 N031 N039 4.7k
Q21_1 N033 N035 0 0 MMBT2222A
R21_3 N026 N033 1Meg
R21_2 out_2 N026 10Meg
R21_6 N045 N044 20k
Vcell21 N028 N037 3.3
Q21_2 N031 N026 out_2 0 MMBT2907A
X§S21 out_1 N039 N037 IRLB8721  ; pins D G S
Q22_3 N043 N047 0 0 MMBT2222A
R22_5 N040 N043 33k
R22_4 N032 N040 4.7k
Q22_1 N034 N036 0 0 MMBT2222A
R22_3 N027 N034 1Meg
R22_2 out_2 N027 10Meg
R22_6 N047 N046 20k
Vcell22 N029 N038 3.3
Q22_2 N032 N027 out_2 0 MMBT2907A
X§S22 out_1 N040 N038 IRLB8721  ; pins D G S
Vcontrol1 VcMAS 0 PULSE(0 5 0 1p 1p 10m 20m)
Vcontrol2 VcMENOS 0 PULSE(0 5 10m 1p 1p 10m 20m)
Voff VcOFF 0 0
Von VcON 0 5
R11_1 N063 VcMAS 20k
R21_1 N035 VcMENOS 20k
R22_1 N036 VcMENOS 20k
R12_1 N064 VcMAS 20k
RL out_pos out_neg 1k
Rout12 out_1 N052 1m
Rout11 out_1 N051 1m
Rout21 out_2 N028 1m
Rout22 out_2 N029 1m
Q1_1 N050 N068 0 0 MMBT2222A
R1_9 N068 VcMENOS 20k
R1_8 N055 N050 300K
R1_7 out_1 N055 570K
Q2_1 N030 N048 0 0 MMBT2222A
R2_9 N048 VcMAS 20k
R2_8 N041 N030 300K
R2_7 out_2 N041 570K
X§S1 out_neg N055 out_1 FQPF47P06  ; pins D G S
X§S2 out_1 N041 out_2 FQPF47P06  ; pins D G S
J§Q1_2 out_1 N050 N055 MMBFJ201
J§Q2_2 out_2 N030 N041 MMBFJ201
X§D2 N041 out_2 1N4736A  ; pins + -
X§D22 N040 out_2 1N4736A  ; pins + -
X§D21 N039 out_2 1N4736A  ; pins + -
X§D11 N062 out_1 1N4736A  ; pins + -
X§D12 N065 out_1 1N4736A  ; pins + -
X§D1 N055 out_1 1N4736A  ; pins + -
Vcontrol3 VcMAS_delayed 0 PULSE(0 5 1m 1p 1p 10m 20m)
Vcontrol4 VcMENOS_delayed 0 PULSE(0 5 10.1m 1p 1p 10m 20m)
CL out_pos N049 1µ
RL2 N049 out_neg 1m
X§Sgnd11 N057 N062 0 IRLB8721  ; pins D G S
X§Sgnd12 N059 N065 0 IRLB8721  ; pins D G S
Q31_1 N017 N021 0 0 MMBT2222A
R31_5 N014 N017 33k
R31_4 N006 N014 4.7k
Q2 N008 N010 0 0 MMBT2222A
R31_3 N001 N008 1Meg
R31_2 out_pos N001 10Meg
R31_6 N021 N020 20k
Vcell31 N003 N012 3.3
Q31_2 N006 N001 out_pos 0 MMBT2907A
X§S31 N025 N014 N012 IRLB8721  ; pins D G S
Q32_1 N018 N023 0 0 MMBT2222A
R32_5 N015 N018 33k
R32_4 N007 N015 4.7k
Q5 N009 N011 0 0 MMBT2222A
R32_3 N002 N009 1Meg
R32_2 out_pos N002 10Meg
R32_6 N023 N022 20k
Vcell32 N004 N013 3.3
Q32_2 N007 N002 out_pos 0 MMBT2907A
X§S32 N019 N015 N013 IRLB8721  ; pins D G S
R31_1 N010 VcMENOS 20k
R32_1 N011 VcMENOS 20k
Rout31 out_pos N003 1m
Rout32 out_pos N004 1m
Q3_1 N005 N024 0 0 MMBT2222A
R3_9 N024 VcMAS 20k
R3_8 N016 N005 300K
R3_7 out_pos N016 570K
X§S3 N019 N016 out_pos FQPF47P06  ; pins D G S
J§Q3_2 out_pos N005 N016 MMBFJ201
X§D3 N016 out_pos 1N4736A  ; pins + -
X§D32 N015 out_pos 1N4736A  ; pins + -
X§D31 N014 out_pos 1N4736A  ; pins + -
R16 N019 out_2 1m
R17 N025 out_2 1m
A1 VcMENOS 0 0 0 0 N020 0 0 BUF
A2 VcMENOS 0 0 0 0 N022 0 0 BUF
A3 VcMENOS 0 0 0 0 N046 0 0 BUF
A4 VcMENOS 0 0 0 0 N044 0 0 BUF
A5 VcMAS 0 0 0 0 N069 0 0 BUF
A6 VcMAS 0 0 0 0 N071 0 0 BUF
.model NPN NPN
.model PNP PNP
.lib standard.bjt
.model NJF NJF
.model PJF PJF
.lib standard.jft
.tran 0 40m 0 10u
.MODEL MMBT2222A  NPN (IS=25.4f NF=1.00 BF=274 VAF=114 IKF=0.121 ISE=14.3p NE=2.00 BR=4.00 NR=1.00 VAR=24.0 IKR=0.300 RE=0.219 RB=0.877 RC=87.7m XTB=1.5 CJE=27.6p VJE=1.10 MJE=0.500 CJC=14.2p VJC=0.300 MJC=0.300 TF=622p TR=124n EG=1.12)
.MODEL MMBT2907A  PNP (IS=60.7f NF=1.00 BF=312 VAF=139 IKF=0.219 ISE=26.0p NE=2.00 BR=4.00 NR=1.00 VAR=20.0 IKR=0.540 RE=85.8m RB=0.343 RC=34.3m XTB=1.5 CJE=50.4p VJE=1.10 MJE=0.500 CJC=23.1p VJC=0.300 MJC=0.300 TF=758p TR=123n EG=1.12)
.model AONS32304 VDMOS(Kp=239 Rs=0.42m Rd=1.2m Rg=3.0 Vto=2.16 VtoTc=-2.8m Bex=-2.07 mtriode=1.1 Ksubthres=0.1 Lambda=0.158 Cgdmax=1420p Cgdmin=288p Cgs=5352p tt=19n A=0.7 Is=2.35E-11 N=1.017 Eg=1.07 Rb=0.1m Trb1=-1 BV=33 IBV=250u M=0.456 Vj=0.56 Cjo=1090.0pF mfg=AOS Vds=30 Ron=1.8m Qg=40n)
.model MMBFJ201 NJF(BETA=0.000896 IS=3E-12 VTO=-0.794 LAMBDA=0.02 RD=0.001 RS=0.0013)
.inc AO3401A.sub
.inc IRLB8721.sub
.inc 1N4736A.sub
.inc FQPF47P06.sub
* .options plotwinsize=0
* .options numdgt=6
* .options reltol=0.001 abstol=1u
* .options solver=alternate
.backanno
.end